# EasyEDA schematic 1-Schematic_spring_remote.json
TITLE: Sheet_1; REV: 1.0; Date: 2019-09-29; Sheet: 1/1; Drawn By: oskarissimus; Company: Your Company
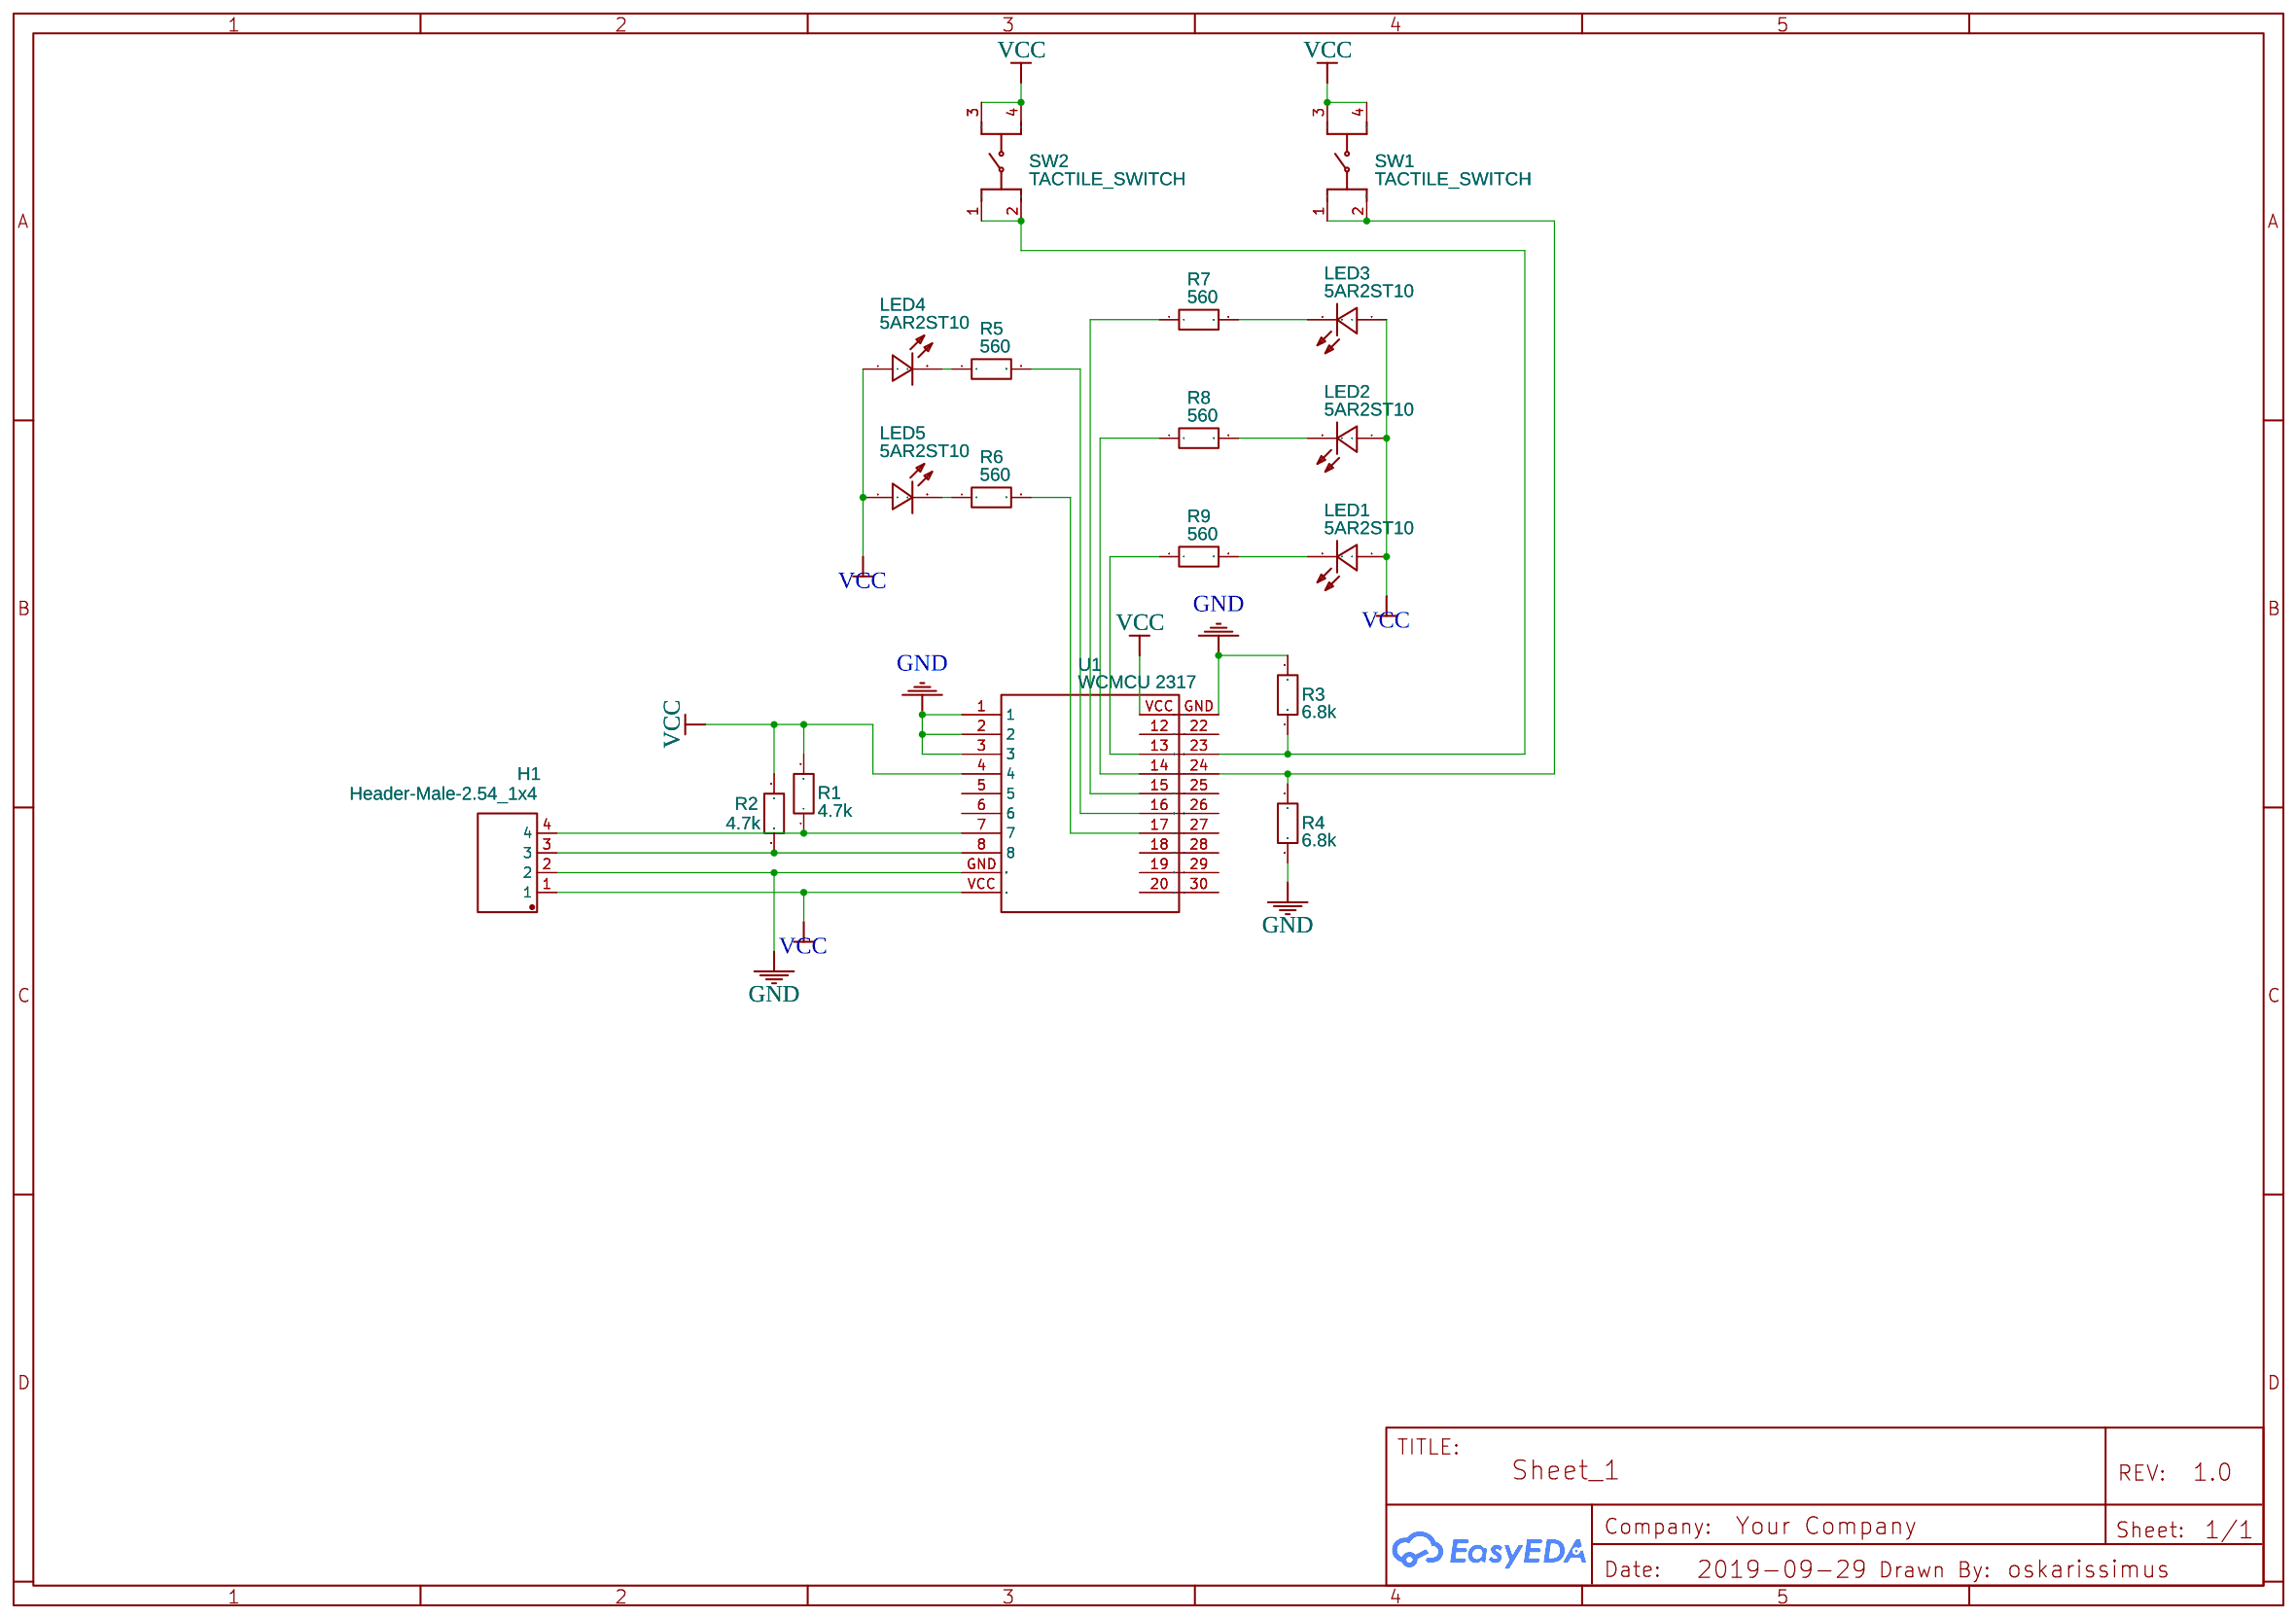
[diagram p0: schematic sheet]

## Parts
H1  Header-Male-2.54_1x4  [DIP-1X4P-2.54MM-M]
LED1  5AR2ST10  [LED-5MM]
LED2  5AR2ST10  [LED-5MM]
LED3  5AR2ST10  [LED-5MM]
LED4  5AR2ST10  [LED-5MM]
LED5  5AR2ST10  [LED-5MM]
R1  4.7k  [AXIAL-0.3]
R2  4.7k  [AXIAL-0.3]
R3  6.8k  [AXIAL-0.3]
R4  6.8k  [AXIAL-0.3]
R5  560  [AXIAL-0.3]
R6  560  [AXIAL-0.3]
R7  560  [AXIAL-0.3]
R8  560  [AXIAL-0.3]
R9  560  [AXIAL-0.3]
SW1  TACTILE_SWITCH  [TACTILE_SWITCH_BIG]
SW2  TACTILE_SWITCH  [TACTILE_SWITCH_BIG]
U1  WCMCU 2317  [WCMCU 2317]

## Library data of the parts
H1 = -: Supplier: LCSC; Manufacturer: Ckmtw; Manufacturer Part: 210S-1*4P L=11.6MMGold-plated black; Contributor: LCSC; Supplier Part: C124378
LED1-LED5 = -: Supplier: LCSC; Manufacturer: KENTO; Supplier Part: C52721
R1-R9 = Res_AXIAL-0.3(1/8W)_EU
SW1 SW2 = -: Supplier: LCSC; Manufacturer: HRO; Manufacturer Part: K2-6639SP-C4SC-04; Supplier Part: C83206
U1 = -: Contributor: oskarissimus

## Nets
GND: H1.2 R3.2 R4.1 U1.1 U1.2 U1.3 U1.GND
VCC: H1.1 LED1.1(A) LED2.1(A) LED3.1(A) LED4.1(A) LED5.1(A) R1.2 R2.1 SW1.3 SW1.4 SW2.3 SW2.4 U1.4 U1.VCC
Net-(H1-3): H1.3 R2.2 U1.8
Net-(H1-4): H1.4 R1.1 U1.7
Net-(LED1-2): LED1.2(K) R9.2
Net-(LED2-2): LED2.2(K) R8.2
Net-(LED3-2): LED3.2(K) R7.2
Net-(LED4-2): LED4.2(K) R5.1
Net-(LED5-2): LED5.2(K) R6.1
Net-(R3-1): R3.1 SW2.1 SW2.2 U1.23
Net-(R4-2): R4.2 SW1.1 SW1.2 U1.24
Net-(R5-2): R5.2 U1.16
Net-(R6-2): R6.2 U1.17
Net-(R7-1): R7.1 U1.15
Net-(R8-1): R8.1 U1.14
Net-(R9-1): R9.1 U1.13

Not connected (* = marked no-connect by the designer): U1 5 6 12 18 19 20 22 25 26 27 28 29 30
